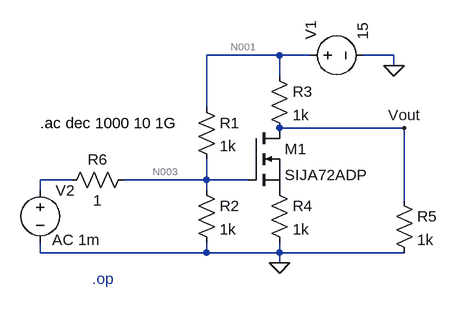
[diagram p0: schematic mosfet_test.asc]
mosfet_test.asc, the LTspice schematic file:
Version 4.1
SHEET 1 880 680
WIRE 240 64 128 64
WIRE 288 64 240 64
WIRE 416 64 368 64
WIRE 416 80 416 64
WIRE 240 96 240 64
WIRE 128 144 128 64
WIRE 432 176 240 176
WIRE -80 256 -128 256
WIRE 128 256 128 224
WIRE 128 256 0 256
WIRE 192 256 128 256
WIRE -128 272 -128 256
WIRE 128 272 128 256
WIRE 432 288 432 176
WIRE -128 368 -128 352
WIRE 128 368 128 352
WIRE 128 368 -128 368
WIRE 240 368 240 352
WIRE 240 368 128 368
WIRE 432 368 240 368
WIRE 240 384 240 368
FLAG 416 80 0
FLAG 432 176 Vout
FLAG 240 384 0
SYMBOL nmos 192 176 R0
SYMATTR InstName M1
SYMATTR Value SIJA72ADP
SYMBOL res 112 128 R0
SYMATTR InstName R1
SYMATTR Value 1k
SYMBOL res 112 256 R0
SYMATTR InstName R2
SYMATTR Value 1k
SYMBOL res 224 80 R0
SYMATTR InstName R3
SYMATTR Value 1k
SYMBOL voltage 272 64 R270
WINDOW 123 0 0 Left 0
WINDOW 39 0 0 Left 0
SYMATTR InstName V1
SYMATTR Value 15
SYMBOL voltage -128 256 R0
WINDOW 3 18 120 Left 2
WINDOW 123 18 92 Left 2
WINDOW 39 0 0 Left 0
SYMATTR InstName V2
SYMATTR Value ""
SYMATTR Value2 AC 1m
SYMBOL res 224 256 R0
SYMATTR InstName R4
SYMATTR Value 1k
SYMBOL res 416 272 R0
SYMATTR InstName R5
SYMATTR Value 1k
SYMBOL res 16 240 R90
WINDOW 0 0 56 VBottom 2
WINDOW 3 32 56 VTop 2
SYMATTR InstName R6
SYMATTR Value 1
TEXT -48 408 Left 2 ;.op
TEXT -128 168 Left 2 !.ac dec 1000 10 1G

The netlist it stands for:
* mosfet_test.asc
M1 Vout N003 P001 P001 SIJA72ADP
R1 N001 N003 1k
R2 N003 0 1k
R3 N001 Vout 1k
V1 N001 0 15
V2 N002 0 AC 1m
R4 P001 0 1k
R5 Vout 0 1k
R6 N003 N002 1
.model NMOS NMOS
.model PMOS PMOS
.lib standard.mos
* .op
.ac dec 1000 10 1G
.backanno
.end

* Results of the author's LTspice run, read from the files saved beside the schematic
* Operating Point, zero values left out:
*   V(n003) = 14.97 mV
*   V(n001) = 15 V
*   V(vout) = 7.5 V
*   V(p001) = 15 nV
*   Id(M1) = 32.18 pA
*   Ig(M1) = -23.95 pA
*   Is(M1) = -8.233 pA
*   I(R2) = 14.97 µA
*   I(V1) = -22.49 mA
*   I(R5) = 7.5 mA
*   I(V2) = 14.97 mA
*   I(R3) = 7.5 mA
*   I(R4) = 15 pA
*   I(R6) = 14.97 mA
*   I(R1) = 14.99 mA
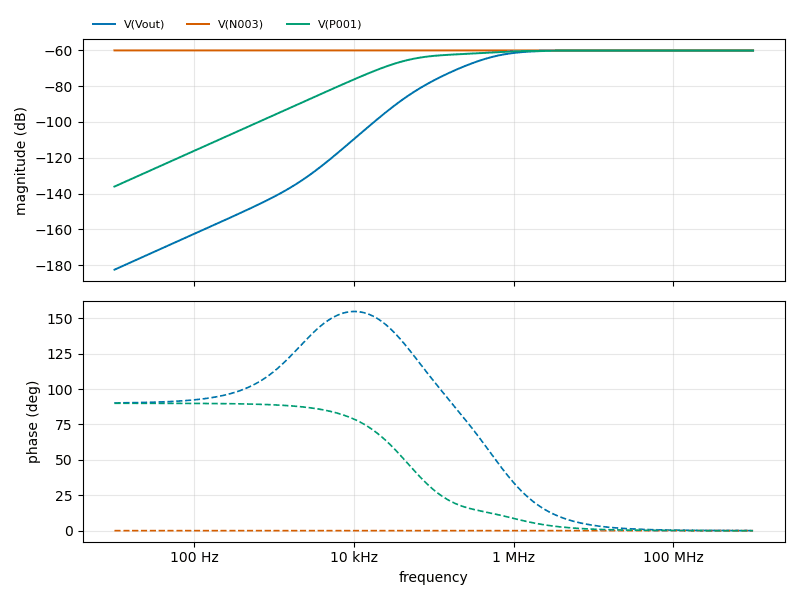
[diagram p1: AC Analysis of mosfet_test.asc, plotted from the saved traces]
* AC Analysis, 1 run:
*   V(Vout): -182.49 dB at 10 Hz, -60.07 dB at 1 GHz, peak -60.07 dB at 1 GHz, 3 dB below the peak at 610.7 kHz
*   V(N003): -60.02 dB at 10 Hz, -60.04 dB at 1 GHz, peak -60.02 dB at 10 Hz
*   V(P001): -136.06 dB at 10 Hz, -60.07 dB at 1 GHz, peak -60.07 dB at 1 GHz, 3 dB below the peak at 99.18 kHz